# Altium schematic sheet isolation.SchDoc
size A4; DocumentNumber: 2; SheetNumber: 2; SheetTotal: 9
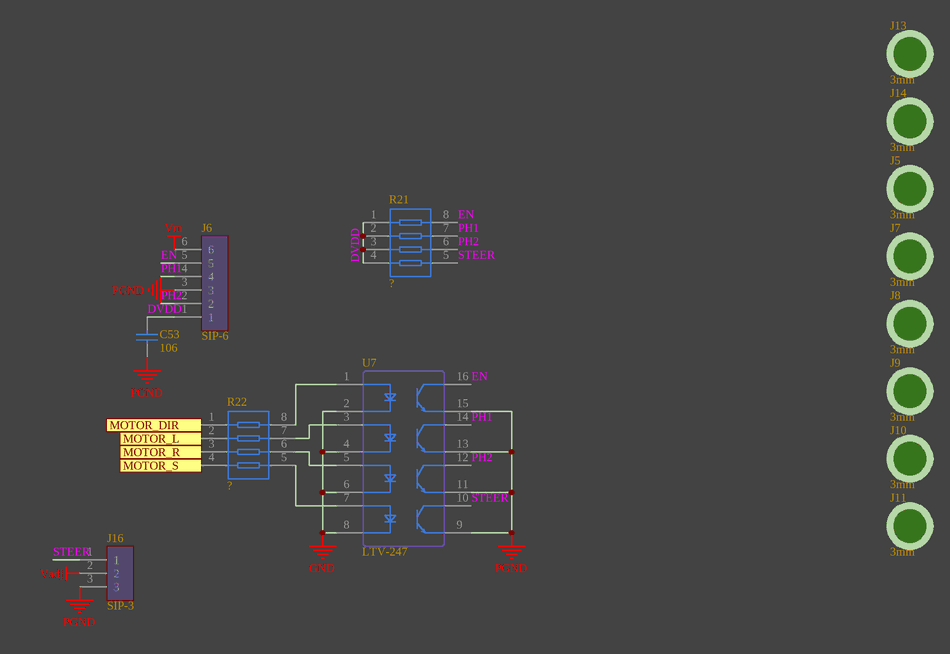
[diagram p0: isolation.SchDoc]

## Parts
C53  106  [C0603]
J5  3mm  [定位孔 3mm]
J6  SIP-6  [PH2.0-6P]
J7  3mm  [定位孔 3mm]
J8  3mm  [定位孔 3mm]
J9  3mm  [定位孔 3mm]
J10  3mm  [定位孔 3mm]
J11  3mm  [定位孔 3mm]
J13  3mm  [定位孔 3mm]
J14  3mm  [定位孔 3mm]
J16  SIP-3  [2.54排针1X3]
R21  ?  [0603_Rx4]
R22  ?  [0603_Rx4]
U7  LTV-247  [WSOP-16]

## Ports
MOTOR_DIR (in), MOTOR_L (in), MOTOR_R (in), MOTOR_S (in)

## Nets
GND: U7.2(CAT1) U7.4(CAT2) U7.6(CAT3) U7.8(CAT4)
PGND: C53.1 J6.3 J16.3 U7.9(EM4) U7.11(EM3) U7.13(EM2) U7.15(EM1)
Vadj: J16.2
Vm: J6.6
DVDD: C53.2 J6.1 R21.1 R21.2 R21.3 R21.4
EN: J6.5 R21.8 U7.16(COL1)
MOTOR_DIR: R22.1 ; port MOTOR_DIR
MOTOR_L: R22.2 ; port MOTOR_L
MOTOR_R: R22.3 ; port MOTOR_R
MOTOR_S: R22.4 ; port MOTOR_S
PH1: J6.4 R21.7 U7.14(COL2)
PH2: J6.2 R21.6 U7.12(COL3)
STEER: J16.1 R21.5 U7.10(COL4)
NetR22_5: R22.5 U7.7(AN4)
NetR22_6: R22.6 U7.5(AN3)
NetR22_7: R22.7 U7.3(AN2)
NetR22_8: R22.8 U7.1(AN1)

## Library data of the parts
C53 = 电容: Capacitor; Value: 22pF; Published: 8-Jun-2000; LatestRevisionDate: 17-Jul-2002; LatestRevisionNote: Re-released for DXP Platform.; PackageReference: RAD-0.3; Publisher: Altium Limited; PackageDescription: Radial Cap, Thru-Hole; 2 Leads; 0.3 in Pin Spacing
J5 J7-J11 J13 J14 = 定位孔
R21 R22 = 贴片排阻*4: 贴片排阻; ComponentLink1Description: 供应商链接; ComponentLink1URL: http://www.szlcsc.com/product/details_20907.html; Package: 0603*4; Supplier: LC; SuppliersPartNumber: C20197
U7 = 4光耦: BOM_Manufacturer: LITEON; Contributor: LCSC; SMT Type: Extend; BOM_Supplier: LCSC; BOM_Manufacturer Part: LTV-247; BOM_Supplier Part: C115451; BOM_LCSC Assembly: Yes; spicePre: U; spiceSymbolName: LTV-247